# EasyEDA schematic SCH_NERC_2025-07-13.json
TITLE: Sheet_1; REV: 1.0; Date: 2025-03-16; Sheet: 1/1; Drawn By: faizaan_baig; Company: Your Company
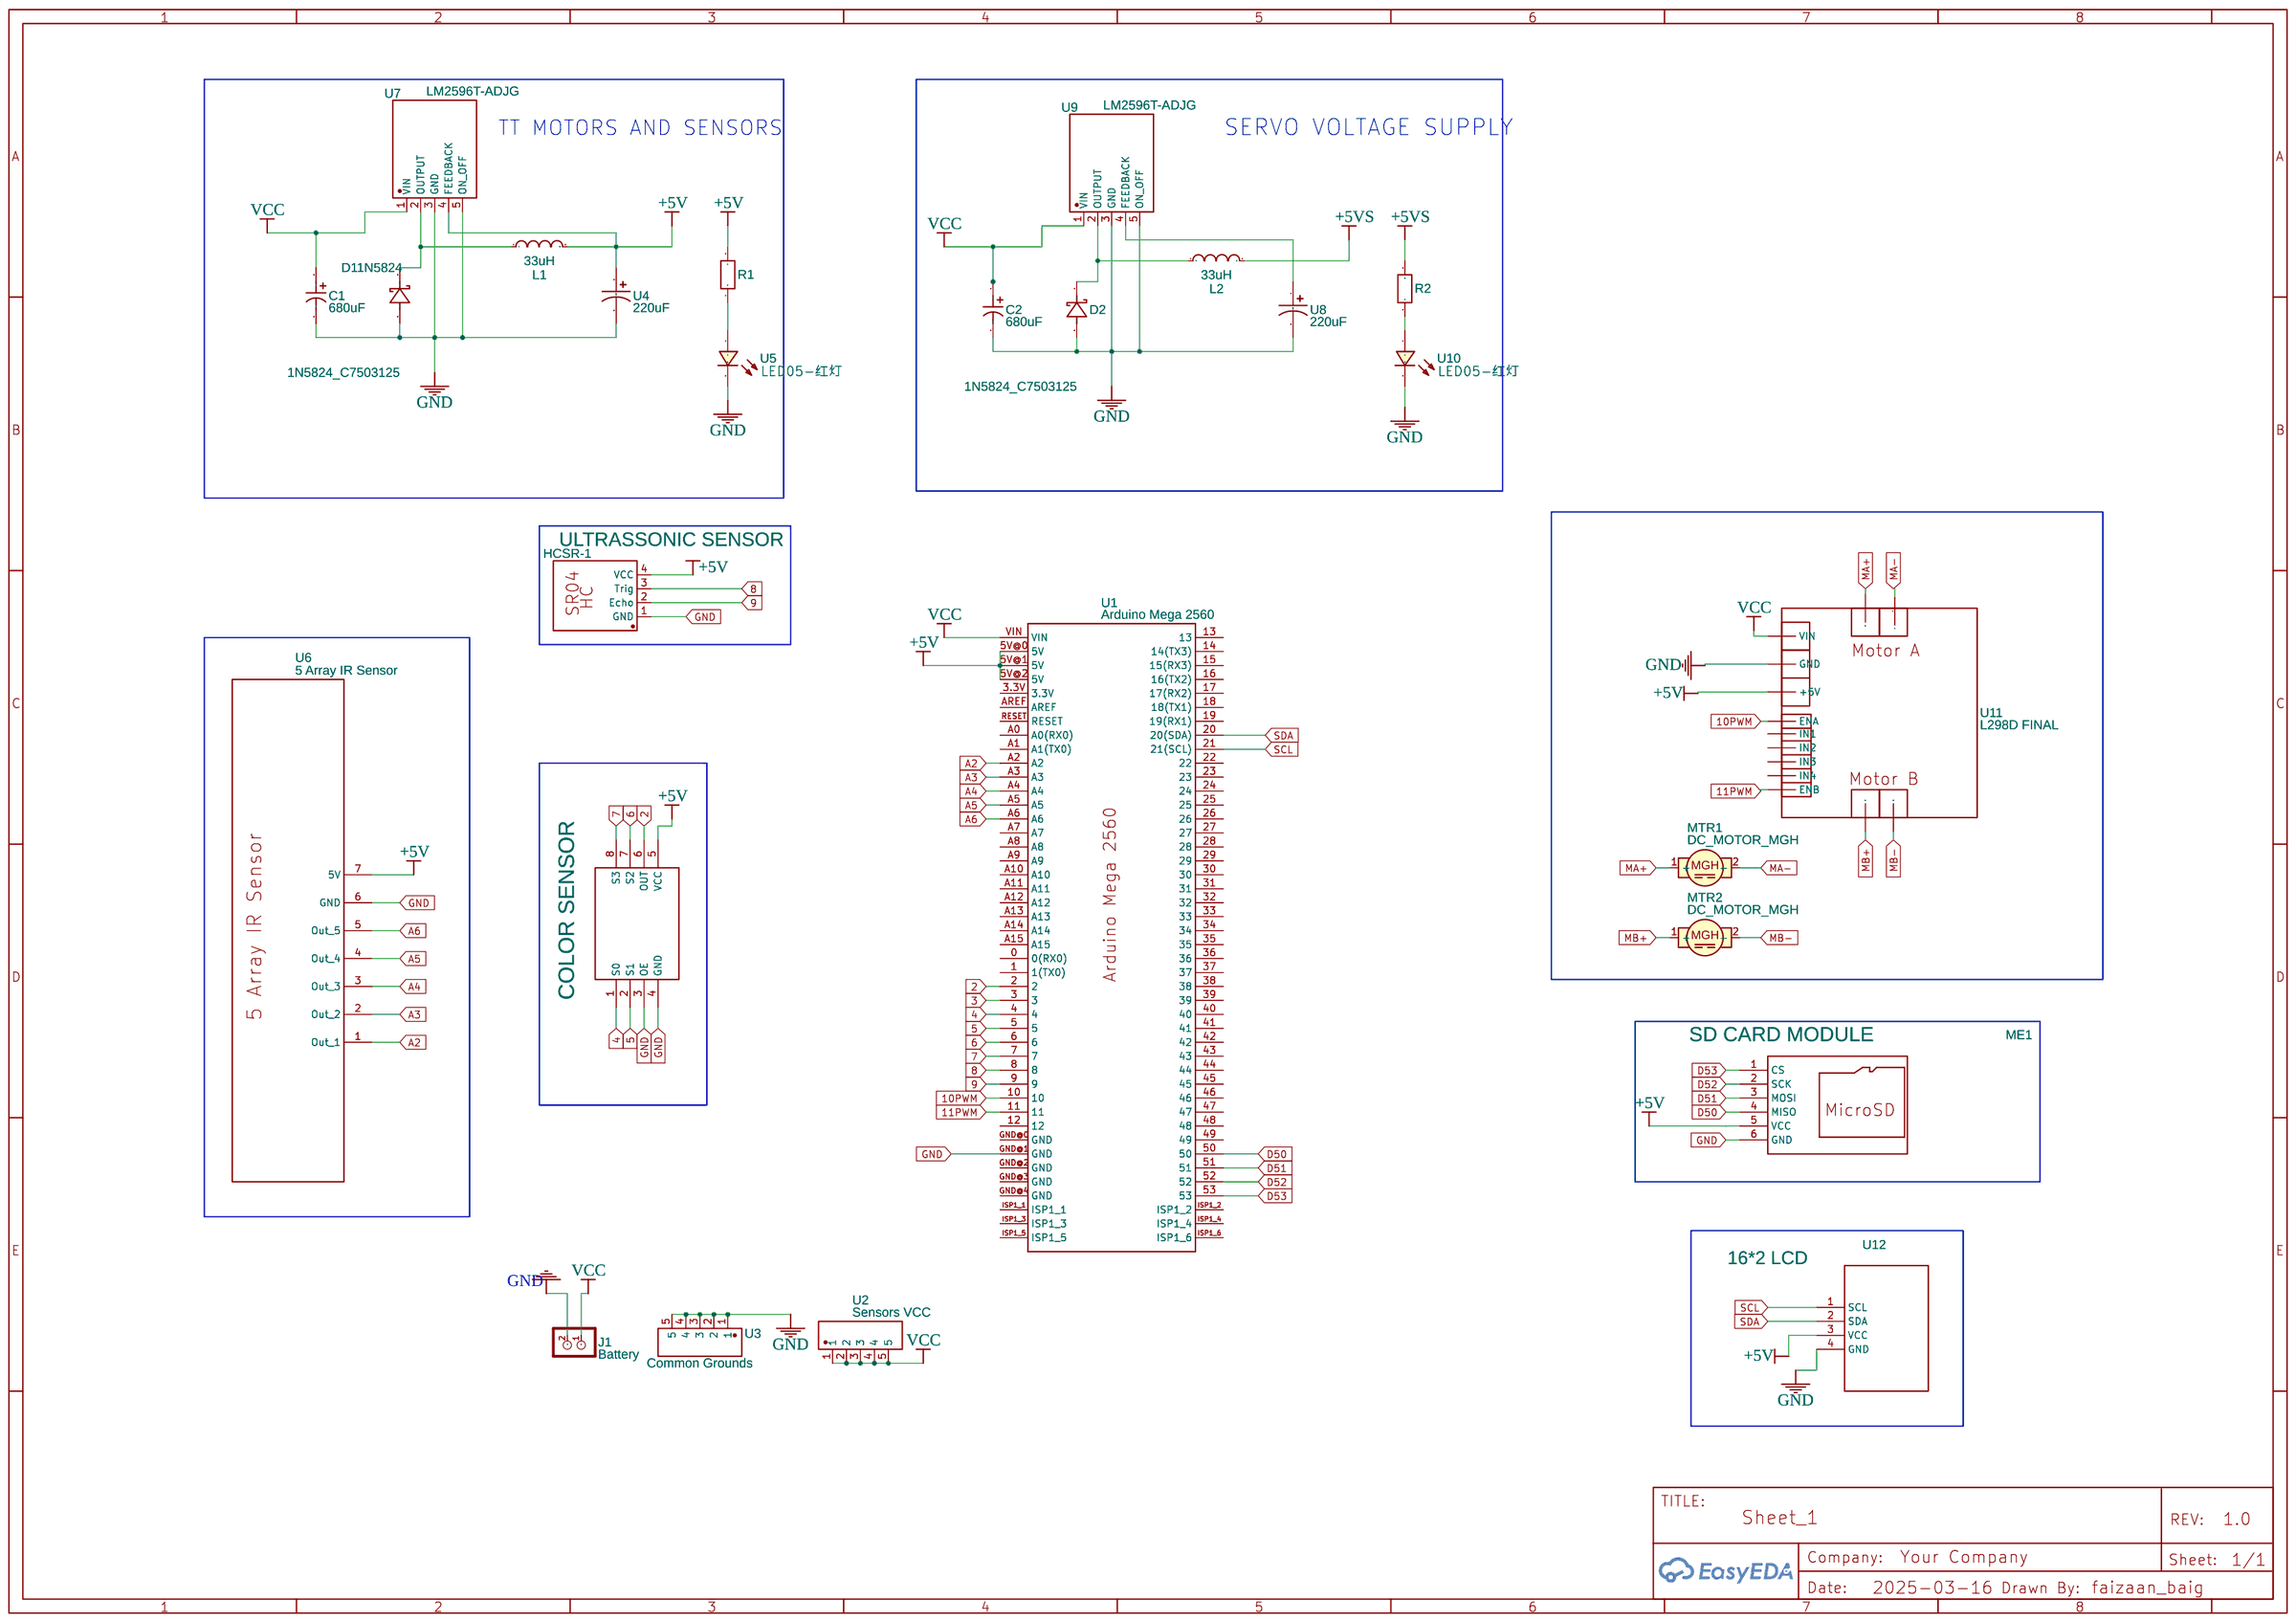
[diagram p0: schematic sheet]

## Parts
C1  680uF  [CAP-TH_BD10.0-P5.00-D1.0-FD]
C2  680uF  [CAP-TH_BD10.0-P5.00-D1.0-FD]
D2  1N5824_C7503125  [DO-27_BD5.3-L8.4-P12.40-D1.3-RD]
D11N5824  1N5824_C7503125  [DO-27_BD5.3-L8.4-P12.40-D1.3-RD]
HCSR-1  ULTRASSONIC SENSOR  [ULTRASSONIC SENSOR HCSR-04]
J1  Battery  [TERMINAL_BLOCK_2P_5]
L1  33uH  [IND-SMD_L5.0-W5.0_FNR5012S]
L2  33uH  [IND-SMD_L5.0-W5.0_FNR5012S]
ME1  SD CARD MODULE  [MICRO_SD_CARD_MODULE_V1]
MTR1  DC_MOTOR_MGH  [MOTOR_239067_GM12F_N20VS_HORIZONTAL]
MTR2  DC_MOTOR_MGH  [MOTOR_239067_GM12F_N20VS_HORIZONTAL]
R1  贴片电阻CHIPRESISTORS  [R0603]
R2  贴片电阻CHIPRESISTORS  [R0603]
SENSOR1  COLOR SENSOR  [TCS230 TCS3200 COLOR SENSOR]
U1  Arduino Mega 2560  [ARDUINO MEGA 2560 ADDON ON PCB]
U2  Sensors VCC  [CONN-TH_HDR-1X5]
U3  Common Grounds  [CONN-TH_HDR-1X5]
U4  220uF  [CAP-TH_BD6.3-P2.50-D0.5-FD]
U5  LED05-红灯  [LED-TH_LED-3MM_RED]
U6  5 Array IR Sensor  [5 ARRAY IR SENSOR]
U7  LM2596T-ADJG  [TO-220-5L_L10.2-W4.5-P1.71-L]
U8  220uF  [CAP-TH_BD6.3-P2.50-D0.5-FD]
U9  LM2596T-ADJG  [TO-220-5L_L10.2-W4.5-P1.71-L]
U10  LED05-红灯  [LED-TH_LED-3MM_RED]
U11  L298D FINAL
U12  16*2 LCD  [GROVE - I2C ADC]

## Library data of the parts
C1 C2 = 22UF400V87EC0285: Contributor: LCSC; Supplier: LCSC; Supplier Part: C2803204; Manufacturer: KNSCHA(科尼盛); JLCPCB Part Class: Extended Part
D2 D11N5824 = 1N5824_C7503125: Supplier: LCSC; Supplier Part: C7503125; Manufacturer: FUXINSEMI(富芯森美); Manufacturer Part: 1N5824; JLCPCB Part Class: Extended Part; Contributor: lcsc
HCSR-1 = ULTRASSONIC SENSOR COPY
J1 = CON_TERMINAL_BLOCK_02-5MM: 2 poles wire to board terminal block; Contributor: DangerousPrototype
L1 L2 = CKCS5040-33UH/M: Contributor: LCSC; Supplier: LCSC; Supplier Part: C354612; Manufacturer: CENKER(岑科); Manufacturer Part: CKCS5040-33uH/M; JLCPCB Part Class: Extended Part
ME1 = CATALEX_MICRO_SD_CARD_MODULE_V1 SURYA: Contributor: Николай Александрович
MTR1 MTR2 = DC_MOTOR_MGH: Contributor: meyerp
R1 R2 = 贴片电阻CHIPRESISTORS: Contributor: lcsc; Supplier: LCSC; Supplier Part: C9900014833; Manufacturer: null; Manufacturer Part: 贴片电阻ChipResistors; JLCPCB Part Class: Extended Part
SENSOR1 = COLOR SENSOR: Contributor: abhijithm819
U1 = Arduino Mega 2560: Arduino Mega board footprint; Contributor: jesienazareth
U2 U3 = HDR-1X5.: Contributor: LCSC; Supplier: LCSC; Supplier Part: C2935751; Manufacturer: null; Manufacturer Part: HDR-1X5插件
U4 U8 = 16YK220M6.3X11: Contributor: lcsc; Supplier: LCSC; Supplier Part: C5114479; Manufacturer: rubycon(红宝石)
U5 U10 = LED05-红灯: Contributor: LCSC; Supplier: LCSC; Supplier Part: C9900009041; Manufacturer: null; JLCPCB Part Class: Extended Part
U6 = 5 Array IR Sensor: Contributor: foysaldurlov
U7 U9 = LM2596T-ADJG: Supplier: LCSC; Supplier Part: C2977087; Manufacturer: HGC(深圳汉芯); JLCPCB Part Class: Extended Part; Contributor: lcsc
U11 = L298D FINAL: Contributor: jyotirmoy
U12 = Grove - I2C ADC: sourceId: V7D93XRKq; Supplier Part: undefined; Supplier: SeeedStudio

## Nets
+5V: HCSR-1.4(VCC) L1.2 ME1.5(VCC) R1.2 SENSOR1.5(VCC) U1.5V@0(5V) U1.5V@1(5V) U1.5V@2(5V) U4.1 U6.7(5V) U7.4(FEEDBACK) U11.13(+5V) U12.3(VCC)
+5VS: L2.2 R2.2
GND: C1.2 C2.2 D2.2(A) D11N5824.2(A) HCSR-1.1(GND) J1.2 ME1.6(GND) SENSOR1.3(OE) SENSOR1.4(GND) U1.GND@1(GND) U3.1 U3.2 U3.3 U3.4 U3.5 U4.2 U5.2 U6.6(GND) U7.3(GND) U7.5(ON_OFF) U8.2 U9.3(GND) U9.5(ON_OFF) U10.2 U11.12(GND) U12.4(GND)
VCC: C1.1 C2.1 J1.1 U1.VIN U2.1 U2.2 U2.3 U2.4 U2.5 U7.1(VIN) U9.1(VIN) U11.11(VIN)
2: SENSOR1.6(OUT) U1.2
3: U1.3
4: SENSOR1.1(S0) U1.4
5: SENSOR1.2(S1) U1.5
6: SENSOR1.7(S2) U1.6
7: SENSOR1.8(S3) U1.7
8: HCSR-1.3(Trig) U1.8
9: HCSR-1.2(Echo) U1.9
10PWM: U1.10 U11.1(ENA)
11PWM: U1.11 U11.6(ENB)
A2: U1.A2 U6.1(Out 1)
A3: U1.A3 U6.2(Out 2)
A4: U1.A4 U6.3(Out 3)
A5: U1.A5 U6.4(Out 4)
A6: U1.A6 U6.5(Out 5)
D50: ME1.4(MISO) U1.50
D51: ME1.3(MOSI) U1.51
D52: ME1.2(SCK) U1.52
D53: ME1.1(CS) U1.53
MA+: MTR1.1(+) U11.8
MA-: MTR1.2(-) U11.7
MB+: MTR2.1(+) U11.10
MB-: MTR2.2(-) U11.9
SCL: U1.21(21(SCL)) U12.1(SCL)
SDA: U1.20(20(SDA)) U12.2(SDA)
Net-(D2-1): D2.1(K) L2.1 U9.2(OUTPUT)
Net-(D11N5824-1): D11N5824.1(K) L1.1 U7.2(OUTPUT)
Net-(R1-1): R1.1 U5.1
Net-(R2-1): R2.1 U10.1
Net-(U8-1): U8.1 U9.4(FEEDBACK)

Not connected (* = marked no-connect by the designer): U1 0(0(RX0)) 1(1(TX0)) 3.3V 12 13 14(14(TX3)) 15(15(RX3)) 16(16(TX2)) 17(17(RX2)) 18(18(TX1)) 19(19(RX1)) 22 23 24 25 26 27 28 29 30 31 32 33 34 35 36 37 38 39 40 41 42 43 44 45 46 47 48 49 A0(A0(RX0)) A1(A1(TX0)) A7 A8 A9 A10 A11 A12 A13 A14 A15 AREF GND@0(GND) GND@2(GND) GND@3(GND) GND@4(GND) ISP1_1 ISP1_2 ISP1_3 ISP1_4 ISP1_5 ISP1_6 RESET; U11 2(IN1) 3(IN2) 4(IN3) 5(IN4)

## Notes on the sheet
- TT MOTORS AND SENSORS
- SERVO VOLTAGE SUPPLY
